# Altium project Radio_Controller.PrjPcb
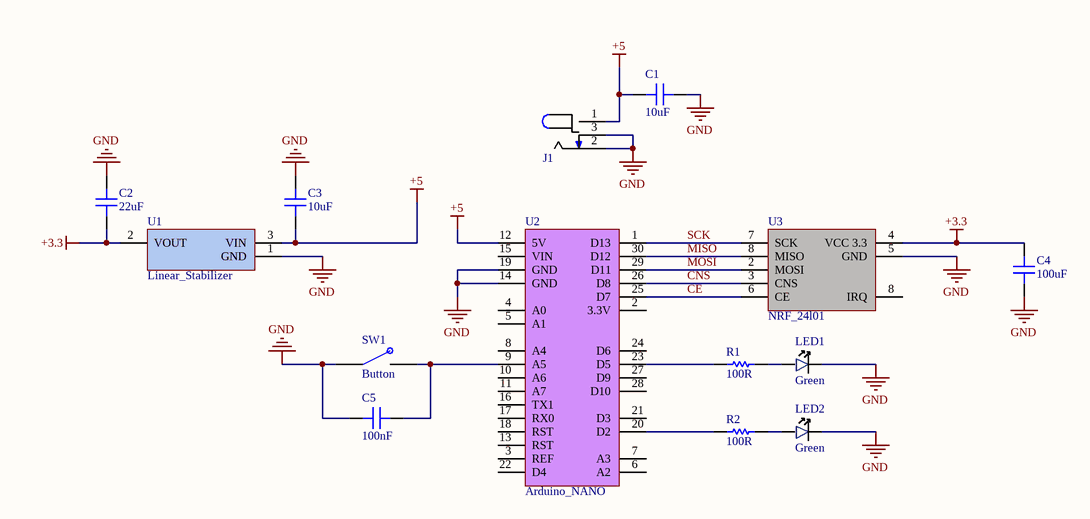
[diagram p0: Radio_Controller.SchDoc]
1 sheet, 14 parts. Net scope: global (net labels, ports and power ports of the same name join across sheets).
Board file: Radio_Controller.PcbDoc

## Sheet Radio_Controller.SchDoc
size A; SheetNumber: 1; SheetTotal: 1

### Parts
C1  10uF  [CAP 1206]
C2  22uF  [CAP 1206]
C3  10uF  [CAP 1206]
C4  100uF  [CAP 1206]
C5  100nF  [CAP 0603]
J1  Power Jack  [Power_Jack]  (value not drawn)
LED1  value Green  [LED_0603]  (hidden comment: 0603Gr)
LED2  value Green  [LED_0603]  (hidden comment: 0603Gr)
R1  100R  [RES 0603]
R2  100R  [RES 0603]
SW1  Button  [Button]
U1  Linear_Stabilizer  [TO-220]
U2  Arduino_NANO  [MODULE_ABX00028]
U3  NRF_24l01  [NRF24L01]

### Nets
+3.3: C2.2 C4.1 U1.2(VOUT) U3.4(VCC_3.3)
+5: C1.2 C3.2 J1.1 U1.3(VIN) U2.12(5V)
GND: C1.1 C2.1 C3.1 C4.2 C5.2 J1.2 J1.3 LED1.2 LED2.2 SW1.1 U1.1(GND) U2.14(GND) U2.19(GND) U3.5(GND)
CE: U2.25(D7) U3.6(CE)
CNS: U2.26(D8) U3.3(CNS)
MISO: U2.30(D12) U3.8(IRQ)
MOSI: U2.29(D11) U3.2(MOSI)
SCK: U2.1(D13) U3.7(SCK)
NetC5_1: C5.1 SW1.2 U2.9(A5)
NetLED1_1: LED1.1 R1.2
NetLED2_1: LED2.1 R2.2
NetR1_1: R1.1 U2.23(D5)
NetR2_1: R2.1 U2.20(D2)

Not connected (* = marked no-connect by the designer): U2 2(3.3V) 3(REF) 4(A0) 5(A1) 6(A2) 7(A3) 8(A4) 10(A6) 11(A7) 13(RST) 15(VIN) 16(TX1) 17(RX0) 18(RST) 21(D3) 22(D4) 24(D6) 27(D9) 28(D10)

### Library data of the parts
C1-C5 = Capacitor: SMT Capacitor
  C1 C3: Value: 10uF
  C2: Value: 22uF
  C4: Value: 100uF
  C5: Value: 100nF
J1 = P_Power Jack: Power Barrel Connector Jack 2.10mm ID (0.083"), 5.50mm OD (0.217") Through Hole, Right Angle; MFR Part #: PJ-102A; Value: CONN PWR JACK 2X5.5MM SOLDER; Digikey Link: https://www.digikey.com/product-detail/en/PJ-102A/CP-102A-ND/275425/?itemSeq=304982367; LCSC Part#: C136744; Type: Extended
LED1 LED2 = LED_GREEN_0603: LIGHT EMITTING DIODES (LED) GREEN 520~535NM 112~258MCD@20MA TOP VIEW 0603 ROHS; MFR Part #: 19-217/GHC-YR1S2/3T; Type: Basic; LCSC Part#: C72043
R1 R2 = Res: Resistor; Ordered by: Subcon; Published: 8-Jun-2000; Revision: July-2002: Re-released for DXP Platform.; Publisher: Altium Limited; Value: 100R